# EAGLE design booster_2.01_32U4 (EAGLE 9.4.2)
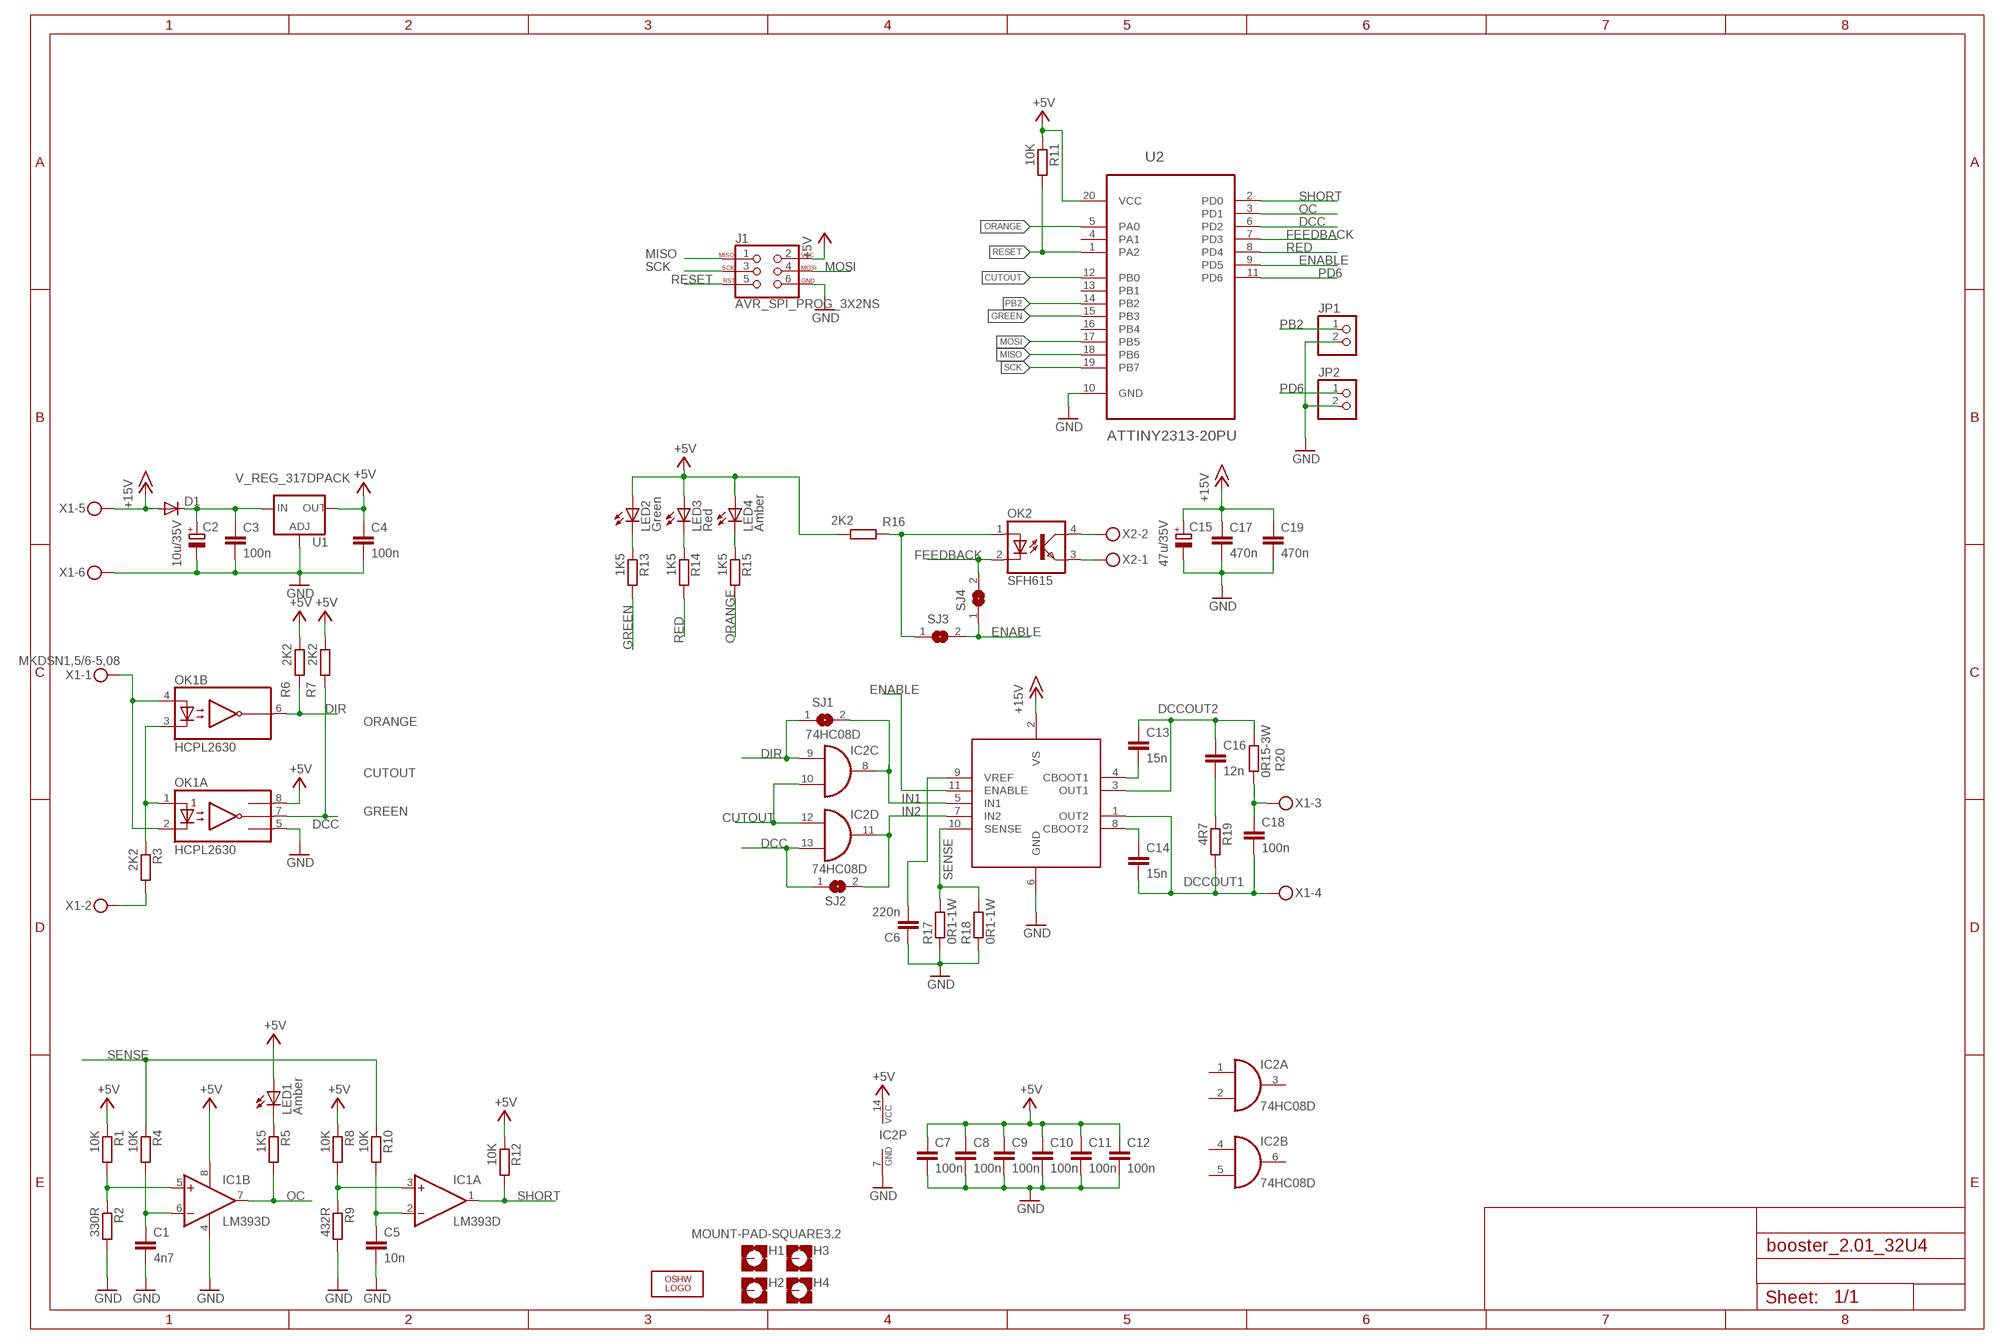
[diagram p0: schematic, sheet 1]

## Parts
C1  4n7  C-EUC0805  [C0805]
C2  10u/35V  CPOL-EUE2.5-5  [E2,5-5]
C3  100n  C-EUC0805  [C0805]
C4  100n  C-EUC0805  [C0805]
C5  10n  C-EUC0805  [C0805]
C6  220n  C-EUC0805  [C0805]
C7  100n  C-EUC0805  [C0805]
C8  100n  C-EUC0805  [C0805]
C9  100n  C-EUC0805  [C0805]
C10  100n  C-EUC0805  [C0805]
C11  100n  C-EUC0805  [C0805]
C12  100n  C-EUC0805  [C0805]
C13  15n  C-EUC0805  [C0805]
C14  15n  C-EUC0805  [C0805]
C15  47u/35V  CPOL-EUE2.5-5  [E2,5-5]
C16  12n  C-EUC0805  [C0805]
C17  470n  C-EUC1812  [C1812]
C18  100n  C-EUC0805  [C0805]
C19  470n  C-EUC1812  [C1812]
D1  DIODE-SMB  [SMB]
H1  MOUNT-PAD-SQUARE3.2  [3,2-PAD-SQUARE]
H2  MOUNT-PAD-SQUARE3.2  [3,2-PAD-SQUARE]
H3  MOUNT-PAD-SQUARE3.2  [3,2-PAD-SQUARE]
H4  MOUNT-PAD-SQUARE3.2  [3,2-PAD-SQUARE]
IC1  LM393D  [SO08]
IC2  74HC08D  [SO14]
J1  AVR_SPI_PROG_3X2NS  [2X3-NS]
JP1  PINHD-1X2  [1X02]
JP2  PINHD-1X2  [1X02]
LED1  Amber  LED3MM  [LED3MM]
LED2  Green  LED3MM  [LED3MM]
LED3  Red  LED3MM  [LED3MM]
LED4  Amber  LED3MM  [LED3MM]
LOGO1  OSHW_LOGO_6MILX0200-NT  [OSHW_6X200_NOTEXT]
OK1  HCPL2630  [DIL08]
OK2  SFH615  [DIL04]
R1  10K  R-EU_R0805  [R0805]
R2  330R  R-EU_R0805  [R0805]
R3  2K2  R-EU_R0805  [R0805]
R4  10K  R-EU_R0805  [R0805]
R5  1K5  R-EU_R0805  [R0805]
R6  2K2  R-EU_R0805  [R0805]
R7  2K2  R-EU_R0805  [R0805]
R8  10K  R-EU_R0805  [R0805]
R9  432R  R-EU_R0805  [R0805]
R10  10K  R-EU_R0805  [R0805]
R11  10K  R-EU_R0805  [R0805]
R12  10K  R-EU_R0805  [R0805]
R13  1K5  R-EU_R0805  [R0805]
R14  1K5  R-EU_R0805  [R0805]
R15  1K5  R-EU_R0805  [R0805]
R16  2K2  R-EU_R0805  [R0805]
R17  0R1-1W  R-EU_R2512  [R2512]
R18  0R1-1W  R-EU_R2512  [R2512]
R19  4R7  R-EU_R0805  [R0805]
R20  0R15-3W  R-EU_0817/7V  [P0817V]
SJ1  SJ  [SJ]
SJ2  SJ  [SJ]
SJ3  SJ  [SJ]
SJ4  SJ  [SJ]
U1  V_REG_317DPACK  [V-REG_DPACK]
U2  ATTINY2313-20PU  [DIP254P762X533-20]
U3  L6203  [ZIP_11]
X1  MKDSN1,5/6-5,08  [MKDSN1,5/6-5,08]
X2  MKDSN1,5/2-5,08  [MKDSN1,5/2-5,08]

## Nets
+5V: C4.1 C7.1 C8.1 C9.1 C10.1 C11.1 C12.1 IC1.8(P:V+) IC2.14(P:VCC) J1.2 LED1.A LED2.A LED3.A LED4.A OK1.8(A:VCC) R1.1 R6.1 R7.1 R8.1 R11.1 R12.1 R16.1 U1.4(OUT) U2.20(VCC)
+15V: C15.+ C17.1 C19.1 D1.A U3.2(VS) X1.5
CUTOUT: IC2.10(C:I1) IC2.12(D:I0) U2.12(PB0)
DCC: IC2.13(D:I1) OK1.7(A:VO1) R7.2 SJ2.1 U2.6(PD2)
DCCOUT1: C14.2 C18.2 R19.2 U3.1(OUT2) X1.4
DCCOUT2: C13.1 C16.1 R20.2 U3.3(OUT1)
DIR: IC2.9(C:I0) OK1.6(B:VO2) R6.2 SJ1.1
ENABLE: SJ3.2 SJ4.1 U2.9(PD5) U3.11(ENABLE)
FEEDBACK: OK2.2(C) SJ4.2 U2.7(PD3)
GND: C1.2 C2.- C3.2 C4.2 C5.2 C6.1 C7.2 C8.2 C9.2 C10.2 C11.2 C12.2 C15.- C17.2 C19.2 IC1.4(P:V-) IC2.7(P:GND) J1.6 JP1.2 JP2.2 OK1.5(A:GND) R2.2 R9.2 R17.1 R18.1 U1.1(ADJ) U2.10(GND) U3.6(GND) X1.6
GREEN: R13.2 U2.15(PB3)
IN1: IC2.8(C:O) SJ1.2 U3.5(IN1)
IN2: IC2.11(D:O) SJ2.2 U3.7(IN2)
MISO: J1.1 U2.18(PB6)
MOSI: J1.4 U2.17(PB5)
N$1: OK1.1(A:A1) OK1.3(B:C2) R3.1
N$2: OK1.2(A:C1) OK1.4(B:A2) X1.1
N$3: R3.2 X1.2
N$5: IC1.5(B:+IN) R1.2 R2.1
N$6: C1.1 IC1.6(B:-IN) R4.2
N$7: OK2.4(COL) X2.2
N$8: IC1.3(A:+IN) R8.2 R9.1
N$9: C5.1 IC1.2(A:-IN) R10.2
N$10: OK2.3(EMIT) X2.1
N$11: LED1.K(C) R5.1
N$12: C2.+ C3.1 D1.C U1.3(IN)
N$13: LED2.K(C) R13.1
N$14: C18.1 R20.1 X1.3
N$15: OK2.1(A) R16.2 SJ3.1
N$16: LED3.K(C) R14.1
N$17: LED4.K(C) R15.1
N$20: C6.2 U3.9(VREF)
N$21: C16.2 R19.1
N$23: C13.2 U3.4(CBOOT1)
N$24: C14.1 U3.8(CBOOT2)
OC: IC1.7(B:OUT) R5.2 U2.3(PD1)
ORANGE: R15.2 U2.5(PA0)
PB2: JP1.1 U2.14(PB2)
PD6: JP2.1 U2.11(PD6)
RED: R14.2 U2.8(PD4)
RESET: J1.5 R11.2 U2.1(PA2)
SCK: J1.3 U2.19(PB7)
SENSE: R4.1 R10.1 R17.2 R18.2 U3.10(SENSE)
SHORT: IC1.1(A:OUT) R12.2 U2.2(PD0)
Unconnected: H1.B3,2(MOUNT) H2.B3,2(MOUNT) H3.B3,2(MOUNT) H4.B3,2(MOUNT) IC2.1(A:I0) IC2.2(A:I1) IC2.3(A:O) IC2.4(B:I0) IC2.5(B:I1) IC2.6(B:O) U2.4(PA1) U2.13(PB1) U2.16(PB4)

## Library data of the parts
C1 C3-C14 C16 C18 = rcl:C-EU: CAPACITOR, European symbol
C2 C15 = rcl:CPOL-EU: POLARIZED CAPACITOR, European symbol; SPICEPREFIX: C
C17 C19 = rcl:C-EU: CAPACITOR, European symbol; SPICEPREFIX: C
D1 = diode:DIODE-: DIODE
H1-H4 = holes:MOUNT-PAD-SQUARE: MOUNTING PAD, square
IC1 = linear:LM393: COMPARATOR
IC2 = 74xx-eu:74*08: Quad 2-input AND gate
J1 = SparkFun-Connectors:AVR_SPI_PROG_3X2: AVR ISP 6 Pin This is the reduced ISP connector for AVR programming. Common on Arduino. This footprint will take up less PCB space and can be used with a 10-pin to 6-pin adapter such as SKU: BOB-08508 **Special note about "TEST_POINT" package. The stop mask is on the top side, so if you want your programming test points to be on the bottom of your board, make sure to place this package on the bottom side of the board. This also ensure that the orientation to program from the bottom side will be correct. SparkFun Products: SparkFun ISP Pogo Adapter <https://www.sparkfun.com/products/11591> - NS Tiny AVR Programmer <https://www.sparkfun.com/products/11801> -PTH
JP1 JP2 = pinhead:PINHD-1X2: PIN HEADER
LED1-LED4 = adafruit:LED: LED OSRAM: - CHIPLED LG R971, LG N971, LY N971, LG Q971, LY Q971, LO R971, LY R971 LH N974, LH R974 LS Q976, LO Q976, LY Q976 LO Q996 - Hyper CHIPLED LW Q18S LB Q993, LB Q99A, LB R99A - SideLED LS A670, LO A670, LY A670, LG A670, LP A670 LB A673, LV A673, LT A673, LW A673 LH A674 LY A675 LS A676, LA A676, LO A676, LY A676, LW A676 LS A679, LY A679, LG A679 - Hyper Micro SIDELED® LS Y876, LA Y876, LO Y876, LY Y876 LT Y87S - SmartLED LW L88C, LW L88S LB L89C, LB L89S, LG L890 LS L89K, LO L89K, LY L89K LS L896, LA L896, LO L896, LY L896 - TOPLED LS T670, LO T670, LY T670, LG T670, LP T670 LSG T670, LSP T670, LSY T670, LOP T670, LYG T670 LG T671, LOG T671, LSG T671 LB T673, LV T673, LT T673, LW T673 LH T674 LS T676, LA T676, LO T676, LY T676, LB T676, LH T676, LSB T676, LW T676 LB T67C, LV T67C, LT T67C, LS T67K, LO T67K, LY T67K, LW E67C LS E67B, LA E67B, LO E67B, LY E67B, LB E67C, LV E67C, LT E67C LW T67C LS T679, LY T679, LG T679 LS T770, LO T770, LY T770, LG T770, LP T770 LB T773, LV T773, LT T773, LW T773 LH T774 LS E675, LA E675, LY E675, LS T675 LS T776, LA T776, LO T776, LY T776, LB T776 LHGB T686 LT T68C, LB T68C - Hyper Mini TOPLED® LB M676 - Mini TOPLED Santana® LG M470 LS M47K, LO M47K, LY M47K Source: http://www.osram.convergy.de/
LOGO1 = ohw-logo:OSHW_LOGO_6MIL
OK1 = optocoupler:HCPL2630: HEWLETT PACKARD OPTO COUPLER; MF: AGILENT TECHNOLOGIES; MPN: HCPL-2630-000E; OC_FARNELL: 9994904; OC_NEWARK: 88H7813
OK2 = optocoupler:SFH615: SIEMENS OPTO COUPLER; MPN: SFH615A-2; OC_FARNELL: 1045382; OC_NEWARK: 97K9544
R1-R16 R19 = rcl:R-EU_: RESISTOR, European symbol
R17 R18 R20 = rcl:R-EU_: RESISTOR, European symbol; SPICEPREFIX: R
SJ1-SJ4 = jumper:SJ: SMD solder JUMPER
U1 = SparkFun-IC-Power:V_REG_317: Voltage Regulator Standard LM317 adjustable voltage regulator. AOI (Adjust Output Input). Google 'LM317 Calculator' for easy to use app to get the two resistor values needed. 240/720 for 5V output. 240/390 for 3.3V output. Spark Fun Electronics SKU : COM-00527; PROD_ID: IC-09888
U2 = Atmel_By_element14_Batch_1-00:ATTINY2313-20PU: Microcontroller; MPN: ATTINY2313-20PU; OC_FARNELL: 9171592; OC_NEWARK: 96K6525; PACKAGE: DIP-20; SUPPLIER: ATMEL
U3 = GJR:L6203: STM L6203 Motor driver; MANUFACTURER: STM; PARTNUMBER: L6203
X1 = con-phoenix-508:MKDSN1,5/6-5,08: MKDSN 1,5/ 6-5,08 Printklemme Nennstrom: 13,5 A Nennspannung: 250 V Rastermaß: 5,08 mm Polzahl: 6 Anschlussart: Schraubanschluss Montage: Löten Anschlussrichtung Leiter/Platine: 0 ° Artikelnummer: 1729160 Source: http://eshop.phoenixcontact.com .. 1729160.pdf
X2 = con-phoenix-508:MKDSN1,5/2-5,08: MKDSN 1,5/ 2-5,08 Printklemme Nennstrom: 13,5 A Nennspannung: 250 V Rastermaß: 5,08 mm Polzahl: 2 Anschlussart: Schraubanschluss Montage: Löten Anschlussrichtung Leiter/Platine: 0 ° Artikelnummer: 1729128 Source: http://eshop.phoenixcontact.com .. 1729128.pdf

## Net classes
0 default: clearance 0.205 mm

## Board
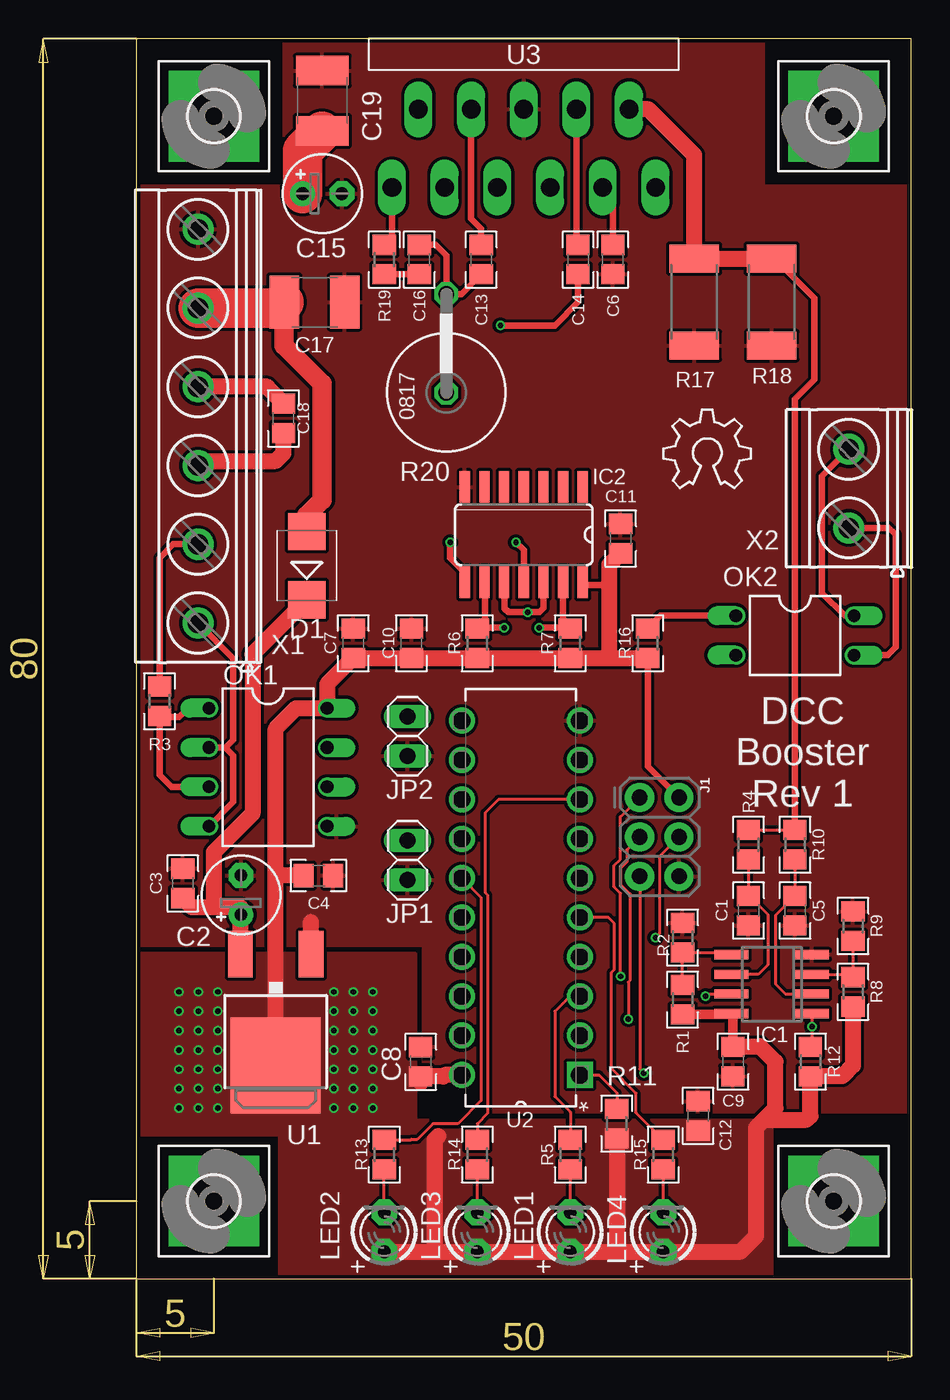
[diagram p1: board, top side]
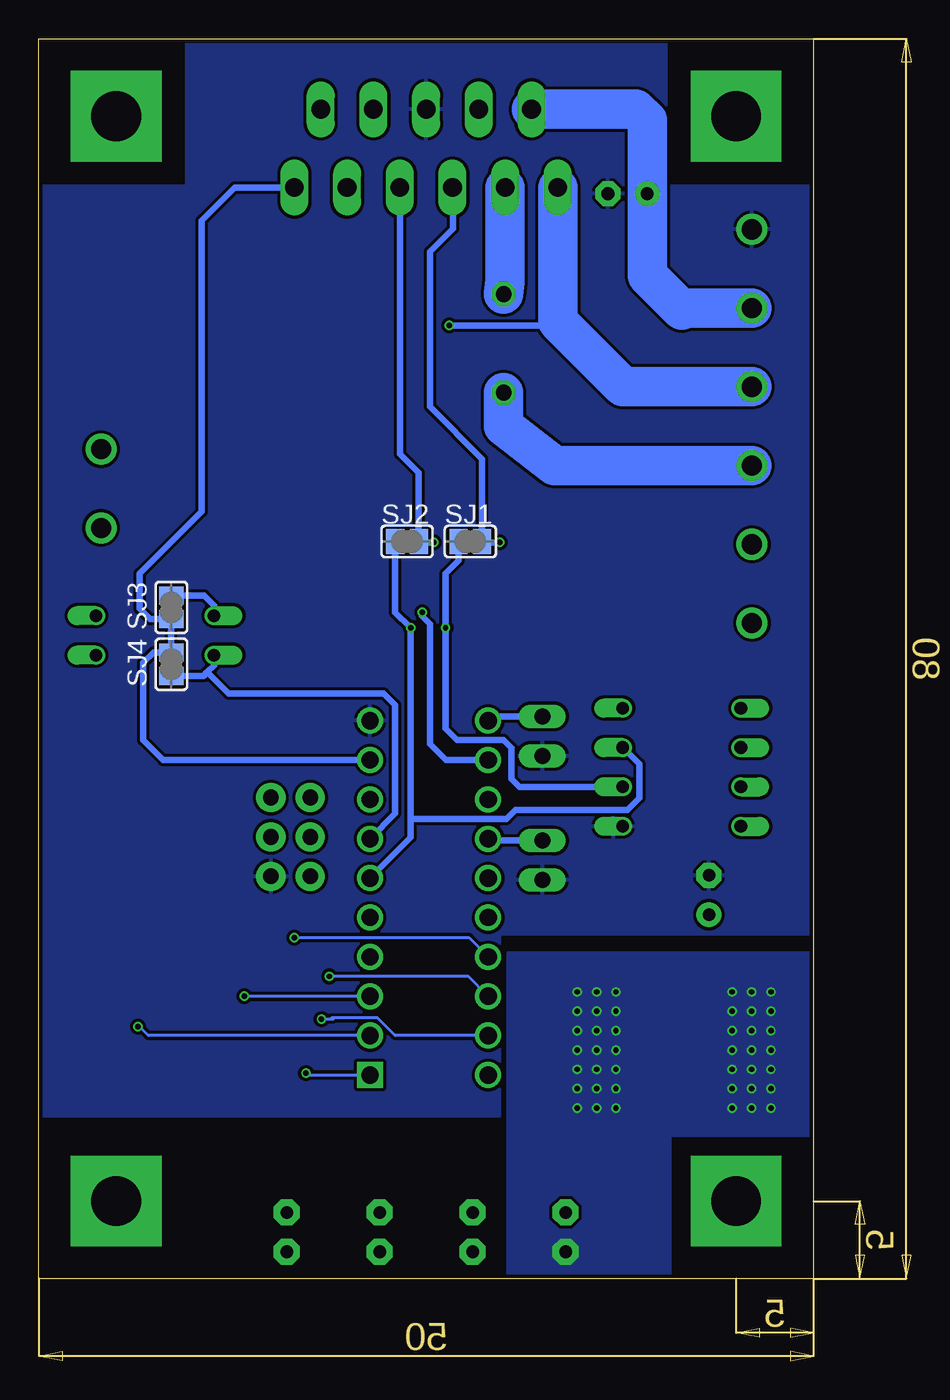
[diagram p2: board, bottom side, seen from below]

Size 50 x 80 mm. Coordinates in mm from the lower left corner, seen from the top.
Outline: 0,0 50,0 50,80 0,80 0,0
Copper layers (1*16): Top 0.018mm / dielectric 1.55mm / Bottom 0.018mm
Design rules "eC_2Layer_PClass6_BaseCopperO18_eCDefault": minimum track width 0.15mm, minimum drill 0.35mm, track to track 0.15mm, track to pad 0.15mm, pad to pad 0.15mm, via to via 0.15mm, smd to smd 0mil, copper to edge 0.25mm, drill to drill 0.35mm, minimum pad ring 0.175mm, minimum via ring 0.125mm, stop-mask expansion 0mil, vias tented up to drill 0.45mm, thermal gap 0.2mm

### Footprints (pad centres in the part's own frame; a part is rotated, then mirrored left to right if it is on the bottom)
C0805 = smd 1.3 x 1.5: 1 -0.95,0; 2 0.95,0
E2,5-5 = drill 0.813 pad 1.6: + -1.27,0 | drill 0.813 pad 1.6 octagon: - 1.27,0
C1812 = smd 1.9 x 3.4: 1 -1.95,0; 2 1.95,0
SMB = smd 2.4 x 2.4: A 2.2,0; C -2.2,0
3,2-PAD-SQUARE = drill 3.2 pad 5.842 square: B3,2 0,0
SO08 = smd 0.6 x 2.2: 1 -1.905,-2.6; 2 -0.635,-2.6; 3 0.635,-2.6; 4 1.905,-2.6; 5 1.905,2.6; 6 0.635,2.6; 7 -0.635,2.6; 8 -1.905,2.6
SO14 = smd 0.66 x 2.032: 1 -3.81,-3.073; 2 -2.54,-3.073; 3 -1.27,-3.073; 4 0,-3.073; 5 1.27,-3.073; 6 2.54,-3.073; 7 3.81,-3.073; 8 3.81,3.073; 9 2.54,3.073; 10 1.27,3.073; 11 0,3.073; 12 -1.27,3.073; 13 -2.54,3.073; 14 -3.81,3.073
2X3-NS = drill 1.016 pad 1.88: 1 -2.54,-1.27; 2 -2.54,1.27; 3 0,-1.27; 4 0,1.27; 5 2.54,-1.27; 6 2.54,1.27
1X02 = drill 1.016 long: 1 -1.27,0; 2 1.27,0
LED3MM = drill 0.813 pad 1.676 octagon: A -1.27,0; K 1.27,0
DIL08 = drill 0.813 offset: 1 -3.81,-3.81; 2 -1.27,-3.81; 3 1.27,-3.81; 4 3.81,-3.81; 5 3.81,3.81; 6 1.27,3.81; 7 -1.27,3.81; 8 -3.81,3.81
DIL04 = drill 0.813 offset: 1 -1.27,-3.81; 2 1.27,-3.81; 3 1.27,3.81; 4 -1.27,3.81
R0805 = smd 1.3 x 1.5: 1 -0.95,0; 2 0.95,0
R2512 = smd 1.8 x 3.2: 1 -2.8,0; 2 2.8,0
P0817V = drill 1.016 octagon: 1 -5.08,0; 2 1.27,0
SJ = smd 1.168 x 1.6: 1 -0.762,0; 2 0.762,0
V-REG_DPACK = smd 1.6 x 3: 1 -2.28,-4.8; 3 2.28,-4.8 | smd 5.8 x 6.2: 4 0,2.38
DIP254P762X533-20 = drill 1.118 square: 1 -7.62,22.86 | drill 1.118: 2 -7.62,20.32; 3 -7.62,17.78; 4 -7.62,15.24; 5 -7.62,12.7; 6 -7.62,10.16; 7 -7.62,7.62; 8 -7.62,5.08; 9 -7.62,2.54; 10 -7.62,0; 11 0,0; 12 0,2.54; 13 0,5.08; 14 0,7.62; 15 0,10.16; 16 0,12.7; 17 0,15.24; 18 0,17.78; 19 0,20.32; 20 0,22.86
ZIP_11 = drill 1.2 long: 1 -8.5,-9.6; 2 -6.8,-4.55; 3 -5.1,-9.6; 4 -3.4,-4.55; 5 -1.7,-9.6; 6 0,-4.55; 7 1.7,-9.6; 8 3.4,-4.55; 9 5.1,-9.6; 10 6.8,-4.55; 11 8.5,-9.6
MKDSN1,5/6-5,08 = drill 1.3 pad 2: 1 -12.7,0.025; 2 -7.62,0.025; 3 -2.54,0.025; 4 2.54,0.025; 5 7.62,0.025; 6 12.7,0.025
MKDSN1,5/2-5,08 = drill 1.3 pad 2: 1 -2.561,0.025; 2 2.519,0.025

### Placement (x,y rotation side)
C1  39.5,23.75 270 top
C2  6.75,24.75 90 top
C3  3,25.5 90 top
C4  11.75,26 0 top
C5  42.5,23.75 270 top
C6  30.75,65.75 90 top
C7  14,41 90 top
C8  18.34,13.99 90 top
C9  38.5,14 270 top
C10  17.75,41 90 top
C11  31.25,47.75 90 top
C12  36.25,10.5 90 top
C13  22.25,65.75 90 top
C14  28.5,65.75 270 top
C15  12,70 0 top
C16  18.25,65.75 270 top
C17  11.5,63 0 top
C18  9.5,55.5 90 top
C19  12,76 90 top
D1  11,46 90 top
H1  45,5 0 top
H2  45,75 0 top
H3  5,5 0 top
H4  5,75 0 top
IC1  41,19 90 top
IC2  25,48 180 top
J1  33.75,28.5 270 top
JP1  17.5,27 270 top
JP2  17.5,35 270 top
LED1  28,3 90 top
LED2  16,3 90 top
LED3  22,3 90 top
LED4  34,3 90 top
LOGO1  34,51 0 top
OK1  8.5,33 270 top
OK2  42.5,41.5 270 top
R1  35.25,18 90 top
R2  35.25,22 90 top
R3  1.5,37.25 90 top
R4  39.5,28 270 top
R5  28,8 90 top
R6  22,41 90 top
R7  28,41 90 top
R8  46.25,18.5 90 top
R9  46.25,22.75 90 top
R10  42.5,28 270 top
R11  31,10 90 top
R12  43.5,14 90 top
R13  16,8 90 top
R14  22,8 90 top
R15  34,8 90 top
R16  33,41 90 top
R17  36,63 90 top
R18  41,63 90 top
R19  16,65.75 90 top
R20  20,62.25 90 top
SJ1  22.15,47.56 0 bottom
SJ2  26.23,47.56 0 bottom
SJ3  41.44,43.31 270 bottom
SJ4  41.44,39.64 270 bottom
U1  8.99,16.13 180 top
U2  21,36 180 top
U3  25,80 0 top
X1  4,55 90 top
X2  46,51 90 top

### Tracks (layer width: path | path; a pad name or v marks a point on that pad's centre or on a via)
+5V  (via drill 0.35)
  Top 0.406: IC2.14 28.99,44.75 30.5,44.75 | J1.2 33,33.06 R16.1
  Top 0.61: C9.1 38.5,17 38.45,17.05 | 38.45,17.05 IC1.8 | R1.1 38.45,17.05
  Top 1.016: LED2.A 19.25,1.73 | 19.25,1.73 LED3.A LED1.A 30.75,1.73 | 30.75,1.73 LED4.A 38.98,1.73 40,2.75 40,9.75 40.5,10.25 | R11.1 31,1.98 30.75,1.73 | 18.34,12.66 C8.1 19.79,13.04 19.89,13.14 U2.20 | 19.25,1.75 19.25,2 | 19.25,2 19.09,1.89 19.25,1.73 | 40.5,10.25 43.25,10.25 43.5,10.5 R12.1 45.55,13.05 46.25,13.75 R8.1 | 40.5,10.25 41.25,11 41.25,14 40.25,15 40.2,14.95 C9.1 | 30.5,40.05 R7.1 R6.1 C10.1 C7.1 12.31,38.36 OK1.8 10.31,36.81 8.99,35.49 8.99,26 | 30.5,40.05 R16.1 | U1.4 8.99,26 | C4.1 8.99,26 | C11.1 30.5,46.05 30.5,44.75 30.5,40.05 | 19.47,9.19 19.25,8.97 19.25,2
  other vias: 4,16 4,14.75 4,13.5 4,12.25 4,11 14,11 14,12.25 14,13.5 14,14.75 14,16 14,17.25 14,18.5 4,17.25 4,18.5 2.75,18.5 2.75,17.25 2.75,16 2.75,14.75 2.75,13.5 2.75,12.25 2.75,11 15.25,11 15.25,12.25 15.25,13.5 15.25,14.75 15.25,16 15.25,17.25 15.25,18.5 5.25,11 5.25,12.25 5.25,13.5 5.25,14.75 5.25,16 5.25,17.25 5.25,18.5 12.75,11 12.75,12.25 12.75,13.5 12.75,14.75 12.75,16 12.75,17.25 12.75,18.5
  pour Top (no thermals): 0,21 18,21 18,10.25 41,10.25 41,0 9.25,0 9.25,9.25 0,9.25
  pour Bottom (no thermals): 0,21 19.75,21 19.75,0 9.25,0 9.25,9.25 0,9.25
+15V
  Top 1.27: C17.1 9.55,60.2 12,57.75 12,50.25 11,49.25 D1.A
  Top 2.54: X1.5 9.17,62.62 C17.1 | C15.+ 10.73,72.78 C19.1
  Bottom 2.54: U3.2 11.45,75.45 10.73,74.73 C15.+ 10.73,64.73 8.5,62.5 8.38,62.62 X1.5
CUTOUT  (via drill 0.35)
  Top 0.406: IC2.10 23.75,44.91 23.75,43.25 24,43 v25.25,43 26,43 26.27,43.27 IC2.12
  Bottom 0.406: U2.12 23.71,33.46 24.75,34.5 24.75,42.25 25.25,42.75 v25.25,43
DCC  (via drill 0.35)
  Top 0.406: v26,42 27.95,42 R7.2 27.54,42.41 IC2.13
  Bottom 0.406: U2.6 26,28.46 26,29.75 | 26,29.75 v26,42 26.99,42.99 SJ2.1 | OK1.7 11.25,33.21 11.25,31 12,30.25 19.25,30.25 19.83,29.67 25.92,29.67 26,29.75
DCCOUT1  (via drill 0.35)
  Top 0.406: U3.1 16.5,67.2 R19.2 | C14.2 28.5,63 27,61.5 v23.5,61.5
  Top 1.016: C18.2 8.5,57.45 8.5,57.5 8.46,57.54 X1.4
  Bottom 0.406: 16.5,61.75 16.75,61.5 v23.5,61.5
  Bottom 2.54: U3.1 16.5,61.75 12.29,57.54 X1.4
DCCOUT2
  Top 0.406: C16.1 19.3,66.7 20,66 R20.2 20.97,63.52 C13.1
  Bottom 2.54: U3.3 19.9,64.37 R20.2
DIR  (via drill 0.35)
  Top 0.406: v23.75,42 22.5,42 | 22.5,42 22.05,42 R6.2 | IC2.9 22.5,44.89 22.5,42
  Bottom 0.406: SJ1.1 22.91,46.34 23.75,45.5 v23.75,42 23.75,35.5 23,34.75 20,34.75 19.5,34.25 19.5,32.25 18.98,31.73 OK1.6
ENABLE
  Bottom 0.406: U3.11 37.35,70.4 39.5,68.25 39.5,49.5 43.5,45.5 43.5,43.25 42.8,42.55 SJ3.2 SJ4.1 42.6,40.4 43.25,39.75 43.25,34.75 41.96,33.46 U2.9
FEEDBACK
  Bottom 0.406: SJ4.2 39.37,38.88 39.12,39.12 | OK2.2 38.69,39.56 39.12,39.12 | U2.7 27,30 27,37 27.75,37.75 37.75,37.75 39.12,39.12
GND
  Top 1.016: U1.1 11.27,23 11.25,23
  pour Bottom: 9.5,80 40.5,80 40.5,70.5 49.75,70.5 49.75,10.5 20.25,10.5 20.25,22.25 0,22.25 0,70.5 9.5,70.5
  pour Top: 0,21.5 18.5,21.5 18.5,10.75 50,10.75 50,70.5 40.5,70.5 40.5,80 9.5,80 9.5,70.5 0,70.5
GREEN
  Top 0.2: R13.2 17.7,8.95 17.75,9 18.13,9 19.13,10 20.75,10 22.25,11.5 22.25,24.59 U2.15
IN1  (via drill 0.35)
  Top 0.406: IC2.8 21.19,45.56 20.25,46.5 v20.25,47.5
  Bottom 0.406: v20.25,47.5 21.33,47.5 SJ1.2 21.39,52.89 24.75,56.25 24.75,66.25 23.25,67.75 23.25,70.35 U3.5
IN2  (via drill 0.35)
  Top 0.406: IC2.11 25,47 v24.5,47.5
  Bottom 0.406: v24.5,47.5 25.41,47.5 SJ2.2 25.5,47.59 25.5,52 26.7,53.2 U3.7
MISO  (via drill 0.35)
  Top 0.2: J1.1 31.23,29.8 31.23,27.05 30.83,26.64 30.83,25.28 31.25,24.86 v31.25,19.5
  Bottom 0.2: U2.18 22.28,19.5 v31.25,19.5
MOSI  (via drill 0.35)
  Top 0.2: J1.4 33.75,27.23 33.75,22.25 v33.5,22
  Bottom 0.2: v33.5,22 22.24,22 U2.17
N$1
  Top 0.406: OK1.1 3.31,36.81 2.75,36.25 1.75,36.25 | 1.75,36.25 1.55,36.25 R3.1 | OK1.3 2.27,31.73 1.5,32.5 1.5,36 1.75,36.25
N$2
  Top 0.406: OK1.4 6.25,30.75 6.25,33.75 5.73,34.27 OK1.2 5.77,34.27 6.25,34.75 6.25,40.02 X1.1
N$3
  Top 0.406: X1.2 2.38,47.38 1.5,46.5 R3.2
N$5
  Top 0.2: R1.2 35.25,21 | 35.25,21 R2.1 | IC1.5 38.3,21 35.25,21
N$6
  Top 0.2: R4.2 C1.1 39.55,24.7 40.75,23.5 40.75,20.25 40.13,19.64 IC1.6
N$7
  Top 0.406: OK2.4 45.73,42.77 44.25,44.25 44.25,51.79 X2.2
N$8
  Top 0.2: R9.1 R8.2 46.06,19.64 IC1.3
N$9
  Top 0.2: R10.2 C5.1 41.25,23.45 41.25,19 41.89,18.36 IC1.2
N$10
  Top 0.406: OK2.3 48.48,40.23 49,40.75 49,48 48.5,48.5 48.44,48.44 X2.1
N$11
  Top 0.2: LED1.K R5.1
N$12
  Top 1.016: C2.+ 6.71,23.98 | 6.71,23.98 U1.3 | C3.1 3.57,23.98 5,23.98 | 5,23.98 6.71,23.98 | D1.C 7.5,40.3 7.5,30 5,27.5 5,23.98
N$13
  Top 0.2: LED2.K R13.1
N$14
  Top 1.016: X1.3 4.27,52.75 9,52.75 9.5,53.25 C18.1
  Bottom 2.54: X1.3 16.71,52.46 20,55 R20.1
N$15
  Top 0.406: R16.2 33.82,42.77 OK2.1
  Bottom 0.406: SJ3.1 39.32,44.07 38.69,43.44 OK2.1
N$16
  Top 0.2: LED3.K R14.1
N$17
  Top 0.2: LED4.K R15.1
N$20
  Top 0.406: U3.9 30.75,69.75 C6.2
N$21
  Top 0.406: R19.1 C16.2
N$23
  Top 0.406: U3.4 21.6,68.4 22.25,67.75 C13.2
N$24
  Top 0.406: U3.8 28.4,66.8 C14.1
OC  (via drill 0.35)
  Top 0.2: IC1.7 36.87,18.36 v36.73,18.23 v36.73,18.22 | U2.3 27.97,18.22 27,17.25 27,11.75 28,10.75 R5.2
  Bottom 0.2: U2.3 v36.73,18.22
ORANGE
  Top 0.2: R15.2 32.25,10.7 32.25,11.95 30.64,13.56 30.64,19.75 30.84,19.95 30.84,22.91 30.45,23.3 U2.5
PB2
  Bottom 0.406: JP1.1 20.89,28.27 U2.14
PD6
  Bottom 0.406: JP2.1 20.73,36.27 U2.11
RED
  Top 0.2: U2.8 23.37,30.92 22.5,30.05 22.5,24.91 22.66,24.76 22.66,10.66 22,10 R14.2
RESET  (via drill 0.35)
  Top 0.2: U2.1 29.86,13.14 31,12 R11.2 | J1.5 32.48,13.52 v32.75,13.25
  Bottom 0.2: v32.75,13.25 32.64,13.14 U2.1
SCK  (via drill 0.35)
  Top 0.2: J1.3 31.66,27.68 31.66,26.89 31.23,26.48 31.23,25.44 31.86,24.82 31.86,19.25 31.75,19.14 v31.75,16.75
  Bottom 0.2: U2.19 27,15.68 28.15,16.82 31.07,16.82 31,16.75 v31.75,16.75
SENSE
  Top 0.2: R4.1 R10.1
  Top 0.406: R10.1 42.5,56.75 43.75,58 43.75,63.25 41.88,65.12 41.67,65.12 R18.2
  Top 1.016: R18.2 R17.2 36,72.5 33.05,75.45 U3.10
SHORT  (via drill 0.35)
  Top 0.2: IC1.1 v43.6,16.25 43.6,15.05 R12.2
  Bottom 0.2: U2.2 42.93,15.68 43.5,16.25 v43.6,16.25

### Text on the board
tPlace: DCC / Booster / Rev 1